# EasyEDA Pro project orpheus esp.epro

# Schematic Schematic1
Board Name: Board1; Create Date: 2025-08-03; Page Name: P1; Project Name: orpheus esp; Schematic Name: Schematic1; Update Date: 2025-08-04; Company: EasyEDA.com; Page Size: A4; Version: V1.0
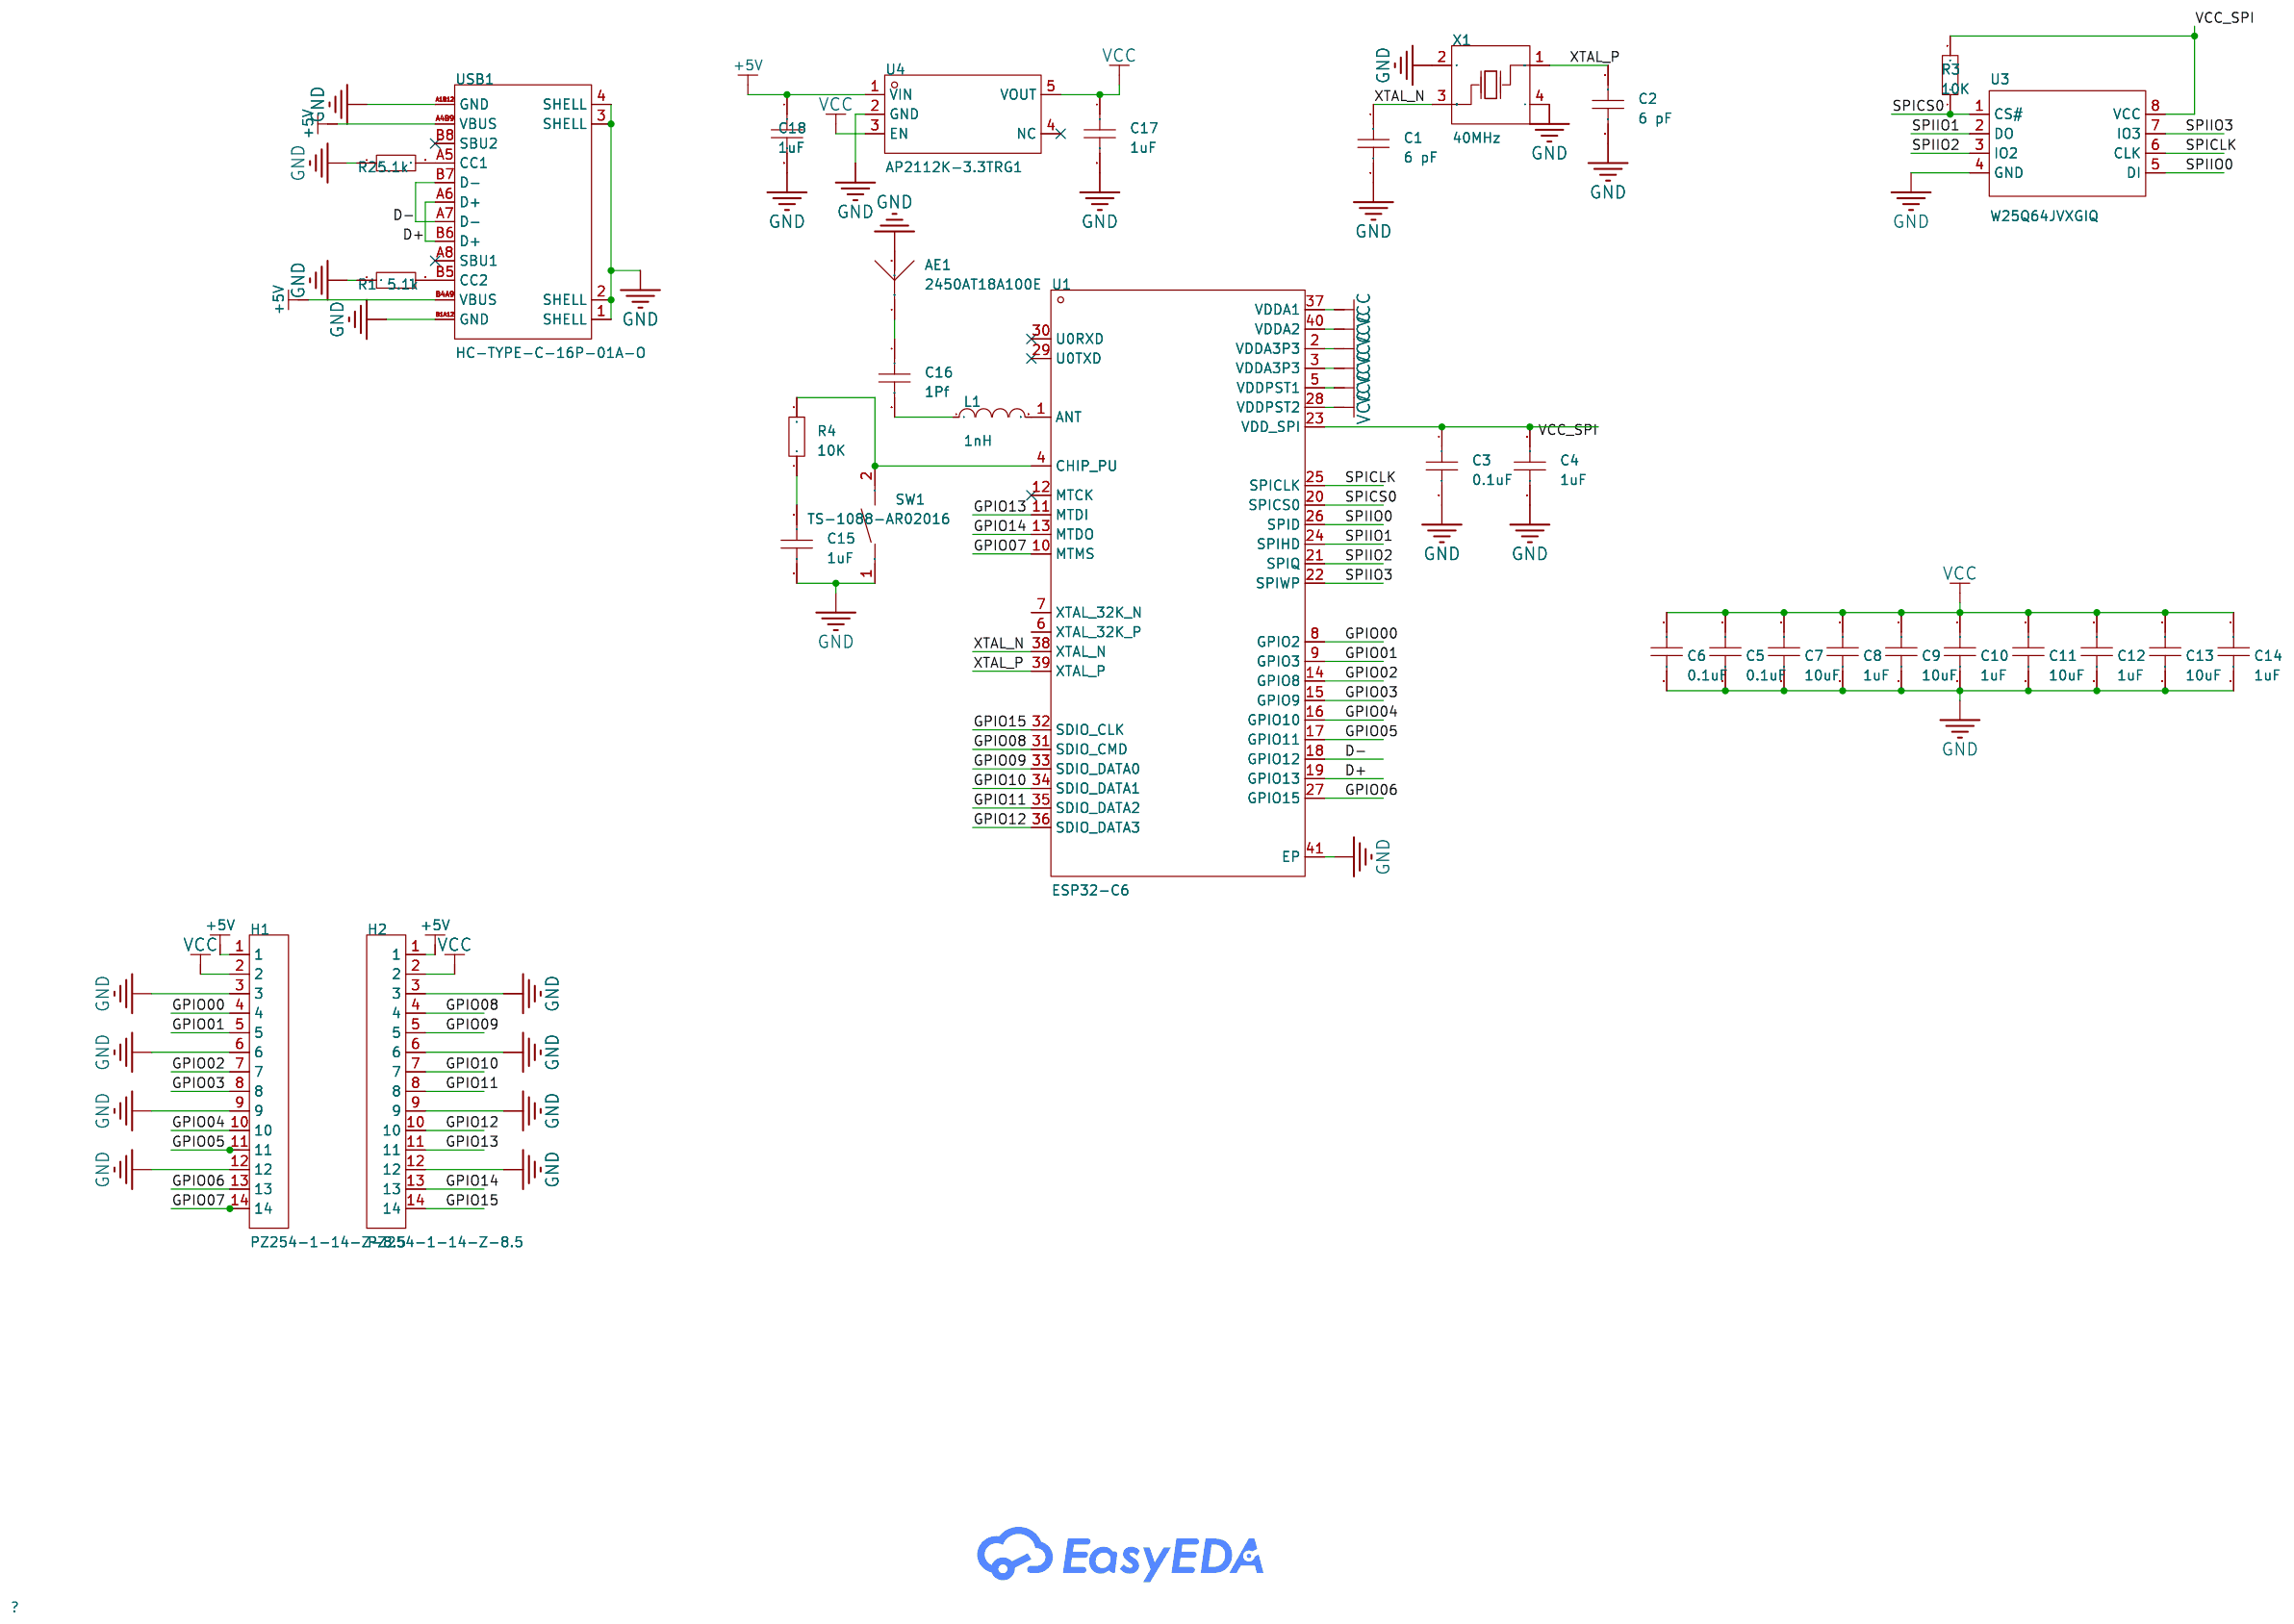
[diagram p0: schematic sheet]

## Parts
AE1  2450AT18A100E  [ANT-SMD_L3.2-W1.6]
C1  6 pF  [C0402_NEW]
C2  6 pF  [C0402_NEW]
C3  0.1uF  [C0402_NEW]
C4  1uF  [C0402_NEW]
C5  0.1uF  [C0402_NEW]
C6  0.1uF  [C0402_NEW]
C7  10uF  [C0402_NEW]
C8  1uF  [C0402_NEW]
C9  10uF  [C0402_NEW]
C10  1uF  [C0402_NEW]
C11  10uF  [C0402_NEW]
C12  1uF  [C0402_NEW]
C13  10uF  [C0402_NEW]
C14  1uF  [C0402_NEW]
C15  1uF  [C0402_NEW]
C16  1Pf  [C0402_NEW]
C17  1uF  [C0402]
C18  1uF  [C0402]
H1  PZ254-1-14-Z-8.5  [HDR-TH_14P-P2.54-V-M]
H2  PZ254-1-14-Z-8.5  [HDR-TH_14P-P2.54-V-M]
L1  1nH  [L0402-SMD_L1.0-W0.5-MLK1005S7N5JTD25]
R1  5.1k  [R0603]
R2  5.1k  [R0603]
R3  10K  [R0603]
R4  10K  [R0603]
SW1  TS-1088-AR02016  [SW-SMD_L3.9-W3.0-P4.45]
U1  ESP32-C6  [QFN-40_L5.0-W5.0-P0.40-TL-EP3.3]
U3  W25Q64JVXGIQ  [XSON-8_L4.0-W4.0-P0.80-TL-EP]
U4  AP2112K-3.3TRG1  [SOT-25-5_L2.9-W1.6-P0.95-LS2.8-BL]
USB1  HC-TYPE-C-16P-01A-O  [USB-C-SMD_G-SWITCH_GT-USB-7010EN]
X1  40MHz  [CRYSTAL-SMD_4P-L2.0-W1.6-BL]

## Library data of the parts
AE1 = 2450AT18A100E: Antenna Type:2.4G天线 Central Frequency:2.4GHz Bandwidth:- Peak Gain:0.5dBi Peak Gain:0.5dBi Polarization Type:- Impedance:50Ω Power capacity:2W VSWR:- Operating Temperature:-40℃~+125℃ Operating Temperature:-40℃~+125℃; LCSC Part Name: 2.4G天线; Supplier Part: C89334; Manufacturer: JOHANSON(约翰逊); Supplier Footprint: 1206; JLCPCB Part Class: Extended Part; Datasheet: https://atta.szlcsc.com/upload/public/pdf/source/20180301/C89334_15198946260391384223.pdf; Supplier: LCSC; Antenna Type: 2.4G天线; Central Frequency: 2.4GHz; Peak Gain: 0.5dBi; Impedance: 50Ω; Power capacity: 2W; Operating Temperature: -40℃~+125℃
C1-C16 = CAP_0603: Supplier Footprint: 0603
C17 C18 = CAP_0402: Supplier Part: C1525; Supplier Footprint: 0402
H1 H2 = PZ254-1-14-Z-8.5: Pin Structure:1x14P Pitch:2.54mm Row Spacing:- Circluar Pins/Square Pins:Policy Mounting Type:Straight Number of Rows:Single Row Number of Pins:14P Current Rating:3A Voltage Rating (Max):- Length of Mating Pin:6mm Insulation Height:2.5mm Length of End Con; LCSC Part Name: 1x14P 间距:2.54mm 方针 直插; Supplier Part: C2894937; Manufacturer: HCTL(华灿天禄); Supplier Footprint: 插件,P=2.54mm; JLCPCB Part Class: Extended Part; Datasheet: https://atta.szlcsc.com/upload/public/pdf/source/20240305/0F0A2A5C422E5D195558C9C26715A031.pdf; Supplier: LCSC; Pin Structure: 1x14P; Pitch: 2.54mm; Circluar Pins/Square Pins: Policy; Mounting Type: Straight; Number of Rows: Single Row; Number of Pins: 14P; Current Rating: 3A; Length of Mating Pin: 6mm; Insulation Height: 2.5mm; Length of End Connection Pin: 3mm; Contact Material: Brass; Operating Temperature: -40℃~+105℃; Color: Black
L1 = L_0603: Supplier Footprint: L0603
R1-R4 = Res_0603: Supplier Footprint: 0603
SW1 = TS-1088-AR02016: Circuit:SPST Actuator Style:Round Button Operating Force:160gf Mounting Style:Brick nogging Switch Length:4mm Switch Width:3mm Switch Height:2mm Strike Gundam:不带 Contact Current:50mA Voltage Rating (DC):12V Insulation Resistance:100MΩ Actuator/Cap Color:B; LCSC Part Name: 4*3*2mm 立贴 轻触开关; Supplier Part: C720477; Manufacturer: XUNPU(讯普); Supplier Footprint: SMD; JLCPCB Part Class: Basic Part; Datasheet: https://atta.szlcsc.com/upload/public/pdf/source/20200810/C720475_60D09DD6C54279ADDB2DC25100F1CC11.pdf; Supplier: LCSC; Circuit: SPST; Actuator Style: Round Button; Operating Force: 160gf; Mounting Style: Brick nogging; Switch Length: 4mm; Switch Width: 3mm; Switch Height: 2mm; Strike Gundam: 不带; Contact Current: 50mA; Voltage Rating (DC): 12V; Insulation Resistance: 100MΩ; Actuator/Cap Color: Black; Pin Style: SMDSplicing; Mechanical Life: 10万次; Operating Temperature: -30℃~+80℃
U1 = ESP32-C6_C5364646: Supplier Part: C5364646; Manufacturer: ESPRESSIF(乐鑫); Supplier Footprint: QFN-40-EP(5x5); JLCPCB Part Class: Extended Part; Datasheet: https://atta.szlcsc.com/upload/public/pdf/source/20241030/E440DE1A2E0B008553116CD300713F6D.pdf; Supplier: LCSC
U3 = W25Q64JVXGIQ: Interface:SPI Memory Size:64Mbit Clock Frequency:133MHz Voltage - Supply:2.7V~3.6V Voltage - Supply:2.7V~3.6V Program / Erase Cycles:100,000 Cycles Page Programming Time (Tpp):3ms Data Retention - TDR (Year):20 Years; Supplier Part: C2940195; Manufacturer: Winbond(华邦); Supplier Footprint: XSON-8-EP(4x4); JLCPCB Part Class: Extended Part; Datasheet: https://atta.szlcsc.com/upload/public/pdf/source/20220111/96C134BA110DAC08742B3CB6C4519B4C.pdf; Supplier: LCSC; Interface: SPI; Memory Size: 64Mbit; Clock Frequency: 133MHz; Voltage - Supply: 2.7V~3.6V; Program / Erase Cycles: 100,000 Cycles; Page Programming Time (Tpp): 3ms; Data Retention - TDR (Year): 20 Years
U4 = AP2112K-3.3TRG1: Output Type:Fixed Voltage - Supply:6V Output Voltage:3.3V Output Voltage:3.3V Output Current:600mA Power Supply Rejection Ratio (PSRR):65dB@(1kHz) Voltage Dropout:250mV@(600mA) standby current:55uA Noise:50uVrms Features:Enable；Over Temperature Protection; LCSC Part Name: 输入6V 输出3.3V 600mA; Supplier Part: C51118; Manufacturer: DIODES(美台); Supplier Footprint: SOT-25-5; JLCPCB Part Class: Extended Part; Datasheet: https://atta.szlcsc.com/upload/public/pdf/source/20171221/C51118_15138312998391195590.pdf; Supplier: LCSC; Output Type: Fixed; Voltage - Supply: 6V; Output Voltage: 3.3V; Output Current: 600mA; Power Supply Rejection Ratio (PSRR): 65dB@(1kHz); Voltage Dropout: 250mV@(600mA); standby current: 55uA; Noise: 50uVrms; Features: Enable；Over Temperature Protection；Over Current Protection; Operating Temperature: -40℃~+85℃@(Ta); Output Configuration: Positive; Number of Outputs: 1
USB1 = HC-TYPE-C-16P-01A-O: Connector Type:Type-C Standard:USB 3.1 Gender:Female Number of Ports:1 Number of Contacts:16P Mounting Style:卧贴 Current Rating - Power (Max):3A Contact Material:高导铜 Contact Plating:Gold Operating Temperature Range:-25℃~+85℃ Operating Temperature Range:-25; LCSC Part Name: Type-C 母 卧贴; Supplier Part: C2997434; Manufacturer: HCTL(华灿天禄); Supplier Footprint: SMD; JLCPCB Part Class: Extended Part; Datasheet: https://atta.szlcsc.com/upload/public/pdf/source/20221116/BA0148F97D59795AA936F4E81C149370.pdf; Supplier: LCSC; Connector Type: Type-C; Standard: USB 3.1; Gender: Female; Number of Ports: 1; Number of Contacts: 16P; Mounting Style: 卧贴; Current Rating - Power (Max): 3A; Contact Material: 高导铜; Contact Plating: Gold; Operating Temperature Range: -25℃~+85℃; Soldering Temperature(Max): 260℃
X1 = Q22FA12800101: Type:Surface Mount Crystal Frequency:40MHz Normal temperature Frequency Tolerance:±10ppm Normal temperature Frequency Tolerance:±10ppm Load Capacitance: Equivalent Series Resistance(ESR):60Ω Operating Temperature:-40℃~+85℃ Operating Temperature:-40℃~+85℃; LCSC Part Name: 40MHz ±10ppm 10pF; Supplier Part: C255898; Manufacturer: EPSON(爱普生); Supplier Footprint: SMD2016-4P; JLCPCB Part Class: Extended Part; Datasheet: https://atta.szlcsc.com/upload/public/pdf/source/20221017/9A6075544027D4D0443F23E2E889A9CE.pdf; Supplier: LCSC; Type: Surface Mount Crystal; Normal temperature Frequency Tolerance: ±10ppm; Equivalent Series Resistance(ESR): 60Ω; Operating Temperature: -40℃~+85℃

## Nets
+5V: C18.1 H1.1 H2.1 U4.1(VIN) USB1.A4B9(VBUS) USB1.B4A9(VBUS)
GND: AE1.2 C1.2 C2.2 C3.2 C4.1 C5.2 C6.2 C7.2 C8.2 C9.2 C10.2 C11.2 C12.2 C13.2 C14.2 C15.2 C17.2 C18.2 H1.3 H1.6 H1.9 H1.12 H2.3 H2.6 H2.9 H2.12 R1.1 R2.1 SW1.1 U1.41(EP) U3.4(GND) U4.2(GND) USB1.1(SHELL) USB1.2(SHELL) USB1.3(SHELL) USB1.4(SHELL) USB1.A1B12(GND) USB1.B1A12(GND) X1.2 X1.4
VCC: C5.1 C6.1 C7.1 C8.1 C9.1 C10.1 C11.1 C12.1 C13.1 C14.1 C17.1 H1.2 H2.2 U1.2(VDDA3P3) U1.3(VDDA3P3) U1.5(VDDPST1) U1.28(VDDPST2) U1.37(VDDA1) U1.40(VDDA2) U4.3(EN) U4.5(VOUT)
VCC_SPI: C3.1 C4.2 R3.2 U1.23(VDD_SPI) U3.8(VCC)
D+: U1.19(GPIO13) USB1.A6(D+) USB1.B6(D+)
D-: U1.18(GPIO12) USB1.A7(D-) USB1.B7(D-)
GPIO00: H1.4 U1.8(GPIO2)
GPIO01: H1.5 U1.9(GPIO3)
GPIO02: H1.7 U1.14(GPIO8)
GPIO03: H1.8 U1.15(GPIO9)
GPIO04: H1.10 U1.16(GPIO10)
GPIO05: H1.11 U1.17(GPIO11)
GPIO06: H1.13 U1.27(GPIO15)
GPIO07: H1.14 U1.10(MTMS)
GPIO08: H2.4 U1.31(SDIO_CMD)
GPIO09: H2.5 U1.33(SDIO_DATA0)
GPIO10: H2.7 U1.34(SDIO_DATA1)
GPIO11: H2.8 U1.35(SDIO_DATA2)
GPIO12: H2.10 U1.36(SDIO_DATA3)
GPIO13: H2.11 U1.11(MTDI)
GPIO14: H2.13 U1.13(MTDO)
GPIO15: H2.14 U1.32(SDIO_CLK)
SPICLK: U1.25(SPICLK) U3.6(CLK)
SPICS0: R3.1 U1.20(SPICS0) U3.1(CS#)
SPIIO0: U1.26(SPID) U3.5(DI)
SPIIO1: U1.24(SPIHD) U3.2(DO)
SPIIO2: U1.21(SPIQ) U3.3(IO2)
SPIIO3: U1.22(SPIWP) U3.7(IO3)
XTAL_N: C1.1 U1.38(XTAL_N) X1.3(OSC2)
XTAL_P: C2.1 U1.39(XTAL_P) X1.1(OSC1)
$1N4699: R1.2 USB1.B5(CC2)
$1N4816: R2.2 USB1.A5(CC1)
$1N7117: C15.1 R4.1
$1N7121: R4.2 SW1.2 U1.4(CHIP_PU)
$1N7767: L1.2 U1.1(ANT)
$1N7915: C16.2 L1.1
$1N7919: AE1.1(ANT) C16.1

Not connected (* = marked no-connect by the designer): U1 6(XTAL_32K_P) 7(XTAL_32K_N) 12(MTCK)* 29(U0TXD)* 30(U0RXD)*; U4 4(NC)*; USB1 A8(SBU1)* B8(SBU2)*

# Board PCB1
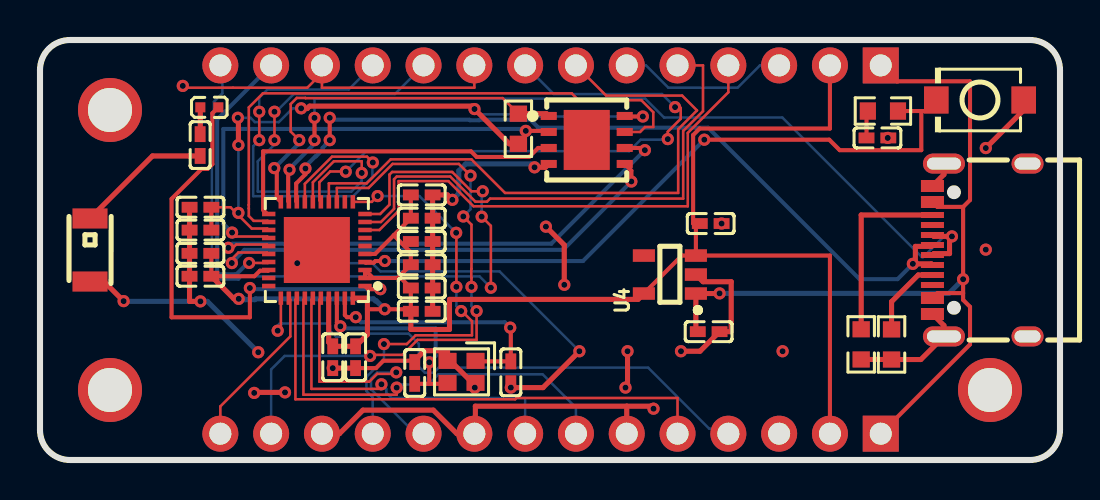
[diagram p1: board, top side]
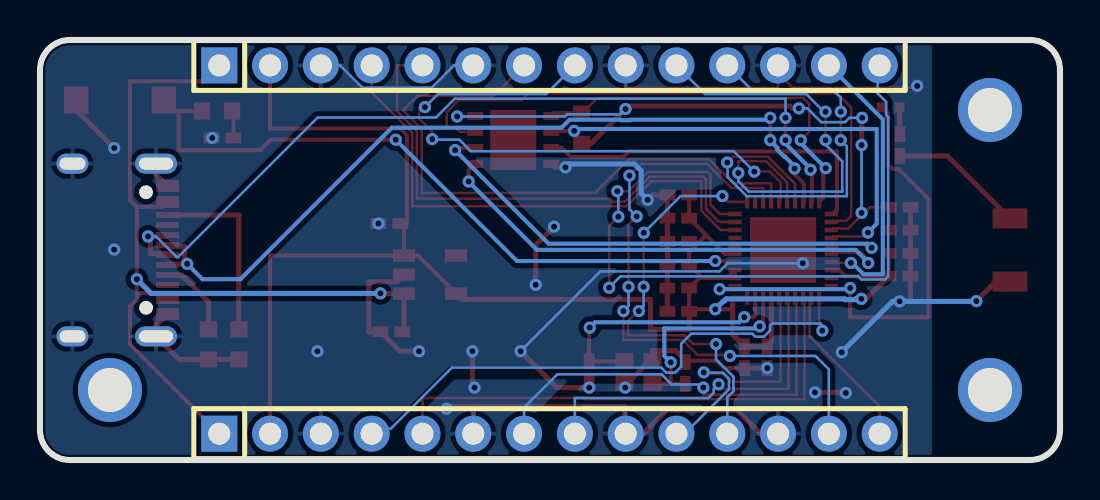
[diagram p2: board, bottom side, seen from below]

Outline 51 x 21 mm; copper layers: Top Layer, Bottom Layer. Coordinates in mm from the lower left corner of the outline.
Outline path: 0,19.5 0,1.5 arc(0.44,0.44) 1.5,0 49.5,0 arc(50.56,0.44) 51,1.5 51,19.5 arc(50.56,20.56) 49.5,21 1.5,21 arc(0.44,20.56) 0,19.5
Stack: Top Layer 0.035mm / Dielectric1 1.51mm FR4 er 4.5 / Bottom Layer 0.035mm

## Design rules (mm)
template: JLCPCB Capability(Two Layers Board)
spacing copperThickness1oz (default): track to track 0.102, other pairs 0.152 to 0.3
spacing copperThickness2oz: track to track 0.203, other pairs 0.152 to 0.3
track width copperThickness1oz (default): min 0.127, default 0.254, max 2.54
track width copperThickness2oz: min 0.203, default 0.254, max 2.54
differential pair differentialPair (default): width min 0.127, default 0.254, max 2.54; gap min 0.152, default 0.152
via viaSize (default): diameter min 0.5, default 0.61, max 10; hole min 0.3, default 0.305, max 6.3

## Placement (name value [footprint] x y rotation side)
AE1  2450AT18A100E  [ANT-SMD_L3.2-W1.6]  2.5 10.5 270 top
C1  6 pF  [C0402_NEW]  18.74 4.35 90 top
C2  6 pF  [C0402_NEW]  23.54 4.39 270 top
C3  0.1uF  [C0402_NEW]  8.02 11.49 180 top
C4  1uF  [C0402_NEW]  8.02 12.64 0 top
C5  0.1uF  [C0402_NEW]  8.02 9.19 180 top
C6  0.1uF  [C0402_NEW]  8.02 10.33 180 top
C7  10uF  [C0402_NEW]  19.09 13.25 0 top
C8  1uF  [C0402_NEW]  19.09 12.09 0 top
C9  10uF  [C0402_NEW]  19.09 10.93 0 top
C10  1uF  [C0402_NEW]  19.09 9.76 0 top
C11  10uF  [C0402_NEW]  19.09 8.6 0 top
C12  1uF  [C0402_NEW]  19.09 7.43 0 top
C13  10uF  [C0402_NEW]  15.78 5.14 270 top
C14  1uF  [C0402_NEW]  14.64 5.14 270 top
C15  1uF  [C0402_NEW]  41.87 16.1 0 top
C16  1Pf  [C0402_NEW]  8.01 15.75 90 top
C17  1uF  [C0402]  33.53 11.82 0 top
C18  1uF  [C0402]  33.43 6.42 0 top
H1  PZ254-1-14-Z-8.5  [HDR-TH_14P-P2.54-V-M]  25.53 19.73 180 bottom
H2  PZ254-1-14-Z-8.5  [HDR-TH_14P-P2.54-V-M]  25.53 1.31 180 bottom
L1  1nH  [L0402-SMD_L1.0-W0.5-MLK1005S7N5JTD25]  8.47 17.63 0 top
NOREF  -  [Pad_e2297]  47.5 3.5 0 top
NOREF#2  -  [Pad_e2300]  3.5 17.5 0 top
NOREF#3  -  [Pad_e2299]  3.5 3.5 0 top
R1  5.1k  [R0603]  41.06 5.78 90 top
R2  5.1k  [R0603]  42.58 5.78 90 top
R3  10K  [R0603]  23.92 16.56 270 top
R4  10K  [R0603]  42.15 17.45 0 top
SW1  TS-1088-AR02016  [SW-SMD_L3.9-W3.0-P4.45]  47 18 180 top
U1  ESP32-C6  [QFN-40_L5.0-W5.0-P0.40-TL-EP3.3]  13.84 10.5 180 top
U3  W25Q64JVXGIQ  [XSON-8_L4.0-W4.0-P0.80-TL-EP]  27.34 16 0 top
U4  AP2112K-3.3TRG1  [SOT-25-5_L2.9-W1.6-P0.95-LS2.8-BL]  31.49 9.27 90 top
USB1  HC-TYPE-C-16P-01A-O  [USB-C-SMD_G-SWITCH_GT-USB-7010EN]  47 10.5 90 top
X1  40MHz  [CRYSTAL-SMD_4P-L2.0-W1.6-BL]  21.08 4.41 180 top

## Footprints (pads in the part's own frame, mm; a bottom-side part is the same pattern mirrored in y, then rotated)
ANT-SMD_L3.2-W1.6
  rect 1x1.75 smd: 1(-1.578,0) 2(1.578,0)
C0402
  rect 0.79x0.54 smd: 1(-0.545,0) 2(0.545,0)
C0402_NEW
  rect 0.79x0.54 smd: 1(-0.545,0) 2(0.545,0)
CRYSTAL-SMD_4P-L2.0-W1.6-BL
  rect 0.9x0.8 smd: 1(-0.7,-0.55) 2(0.7,-0.55) 3(0.7,0.55) 4(-0.7,0.55)
HDR-TH_14P-P2.54-V-M
  rect 1.8x1.8 hole 1.1: 1(-16.51,0)
  round 1.8 hole 1.1: 2(-13.97,0) 3(-11.43,0) 4(-8.89,0) 5(-6.35,0) 6(-3.81,0) 7(-1.27,0) 8(1.27,0) 9(3.81,0) 10(6.35,0) 11(8.89,0) 12(11.43,0) 13(13.97,0) 14(16.51,0)
L0402-SMD_L1.0-W0.5-MLK1005S7N5JTD25
  rect 0.5x0.5 smd: 1(-0.45,0) 2(0.45,0)
Pad_e2297
  round 3.2 hole 2.2: 1(0,0)
Pad_e2299
  round 3.2 hole 2.2: 1(0,0)
Pad_e2300
  round 3.2 hole 2.2: 1(0,0)
QFN-40_L5.0-W5.0-P0.40-TL-EP3.3
  rect 0.665x0.224 smd: 1(-2.408,1.8) 2(-2.408,1.4) 3(-2.408,1) 4(-2.408,0.6) 5(-2.408,0.2) 6(-2.408,-0.2) 7(-2.408,-0.6) 8(-2.408,-1) 9(-2.408,-1.4) 10(-2.408,-1.8) 21(2.408,-1.8) 22(2.408,-1.4) 23(2.408,-1) 24(2.408,-0.6) 25(2.408,-0.2) 26(2.408,0.2) 27(2.408,0.6) 28(2.408,1) 29(2.408,1.4) 30(2.408,1.8)
  rect 0.224x0.665 smd: 11(-1.8,-2.408) 12(-1.4,-2.408) 13(-1,-2.408) 14(-0.6,-2.408) 15(-0.2,-2.408) 16(0.2,-2.408) 17(0.6,-2.408) 18(1,-2.408) 19(1.4,-2.408) 20(1.8,-2.408) 31(1.8,2.408) 32(1.4,2.408) 33(1,2.408) 34(0.6,2.408) 35(0.2,2.408) 36(-0.2,2.408) 37(-0.6,2.408) 38(-1,2.408) 39(-1.4,2.408) 40(-1.8,2.408)
  rect 3.3x3.3 smd: 41(0,0)
R0603
  rect 0.806x0.864 smd: 1(-0.753,0) 2(0.753,0)
SOT-25-5_L2.9-W1.6-P0.95-LS2.8-BL
  rect 0.623x1.105 smd: 1(-0.95,-1.3) 2(-0.001,-1.3) 3(0.95,-1.3) 4(0.95,1.3) 5(-0.95,1.3)
SW-SMD_L3.9-W3.0-P4.45
  rect 1.23x1.36 smd: 1(-2.185,0) 2(2.185,0)
USB-C-SMD_G-SWITCH_GT-USB-7010EN
  oval 1x2.1 hole 0.6x1.7: 1(-4.32,1.802) 2(4.32,1.802)
  oval 1x1.6 hole 0.6x1.3: 3(4.32,-2.377) 4(-4.32,-2.377)
  rect 0.6x1.15 smd: A1B12(-3.2,2.377) A4B9(-2.4,2.377) B1A12(3.2,2.377) B4A9(2.4,2.377)
  rect 0.3x1.15 smd: A5(-1.25,2.377) A6(-0.25,2.377) A7(0.25,2.377) A8(1.25,2.377) B5(1.75,2.377) B6(0.75,2.377) B7(-0.75,2.377) B8(-1.75,2.377)
XSON-8_L4.0-W4.0-P0.80-TL-EP
  rect 0.8x0.4 smd: 1(-1.9,1.2) 2(-1.9,0.4) 3(-1.9,-0.4) 4(-1.9,-1.2) 5(1.9,-1.2) 6(1.9,-0.4) 7(1.9,0.4) 8(1.9,1.2)
  rect 2.3x3 smd: 9(0,0)

## Nets
As in the schematic.

Pads without a net: NOREF 1; NOREF#2 1; NOREF#3 1; U1 6 7 12 29 30; U3 9; U4 4; USB1 A8 B8

## Via types
v1: diameter 0.61, hole 0.305, Top Layer to Bottom Layer, 85 vias

## Routing (per net, layer and track width the routed paths; a pad name or vN(x,y) marks a point on that pad's centre or on a via; arc(x,y) is an arc through that point)
+5V: length 43.4
  Top Layer w0.203: H1.1 42.83,18.93 46.5,18.93 46.5,13 46.16,12.65 ; USB1.A4B9 44.87,8.35 46.16,8.35 ; 46.16,8.35 v1(46.16,9.04) 46.16,12.65 ; 46.16,8.35 46.16,8.01 46.5,7.66 46.5,5.78 H2.1 ; 46.16,12.65 44.87,12.65 USB1.B4A9
  Top Layer w0.254: v1(33.98,8.33) 33.97,8.32 U4.1 32.79,6.51 C18.1
  Bottom Layer w0.254: v1(46.16,9.04) 45.45,8.33 v1(33.98,8.33)
GND: length 127.9
  Top Layer w0.127: 9.66,18.61 7.14,18.61 v1(7.14,18.7) ; H1.9 21.72,18.61 14.1,18.61 14.1,19.35 ; 14.1,19.35 13.36,18.61 9.66,18.61 ; 14.1,19.35 H1.12
  Top Layer w0.203: C1.2 18.74,4.97 17.17,4.97 16.8,4.59 C13.2
  Top Layer w0.254: 7.48,12.64 C6.2 C5.2 7.48,7.93 v1(8.02,7.93) ; v1(30.68,2.56) 30.55,2.69 29.34,2.69 ; v1(14.64,4.59) C13.2 ; 29.34,2.69 H2.6 ; 29.34,2.69 21.77,2.69 21.77,1.37 H2.9 20.84,1.31 19.67,2.49 16.15,2.49 14.97,1.31 H2.12 ; v1(12.25,3.38) 10.74,3.38 v1(10.71,3.35) ; U3.4 25.27,14.63 v1(24.73,14.63) ; R1.1 42.57,5.03 R2.1 44.04,5.02 USB1.1 45.2,6.72 USB1.A1B12 ; v1(4.18,7.94) 3.2,8.92 AE1.2 ; v1(26.21,8.76) 26.21,10.75 v1(25.3,11.67) ; v1(23.54,3.62) 25.15,3.62 v1(26.97,5.44) ; SW1.1 49.19,17.49 v1(47.29,15.6) ; v1(21.74,3.62) 21.74,3.74 20.52,4.96 X1.2 20.38,5.47 19.22,5.47 18.88,5.13 18.88,5.04 C1.2 ; USB1.B1A12 45.2,14.28 USB1.2 ; U4.2 33.15,8.91 34.56,8.91 34.56,6.42 C18.2 33,5.44 v1(32.05,5.44) ; v1(20.62,13.01) 20.37,13.25 C7.2 C8.2 C9.2 C10.2 C11.2 C12.2 ; v1(29.38,5.44) 29.38,3.72 v1(29.27,3.62)
  Bottom Layer w0.127: H1.6 30.3,19.73 31.41,18.61 34.88,18.61 35.99,19.73 H1.3 ; v1(12.86,9.84) 16.61,9.84 17.03,9.43 22.98,9.43 v1(26.97,5.44)
  Bottom Layer w0.254: v1(4.18,7.94) 4.19,7.93 v1(8.02,7.93) 8.37,7.93 v1(10.91,5.39) ; v1(20.62,13.01) 20.94,13.33 20.94,14.46 21.28,14.8 24.56,14.8 v1(24.73,14.63)
  vias: v1(34.08,11.82) v1(37.13,5.44) v1(42.39,16.1) v1(47.29,10.52)
VCC: length 84.1
  Top Layer w0.203: C7.1 C8.1 16.75,10.3 U1.5 ; C6.1 C5.1 10.72,9.19 11,9.47 11.4,9.47 U1.28 ; 16.65,9.1 U1.3 U1.2 16.65,9.1 ; 16.65,9.1 17.88,9.1 ; 17.88,9.1 C10.1 18.54,10.38 17.69,11.23 ; 17.88,9.1 18.04,9.1 C11.1 C12.1 18.44,7.54 16.37,7.54 ; H1.2 39.5,16.57 32.98,16.57 32.66,16.25 32.66,11.82 C17.1 32.79,11.63 U4.3 ; U4.3 39.5,10.22 H2.2 ; U4.3 32.09,10.22 U4.5
  Top Layer w0.254: U4.5 29.9,8.03 20.47,8.03 20.47,6.53 18.54,6.53 C12.1 ; C5.1 9.7,8.06 v1(9.93,8.06) ; 14.44,8.09 14.43,8.08 14.43,5.89 C14.1 C13.1 16.37,6.28 16.37,8.09 U1.40
  Bottom Layer w0.254: v1(9.93,8.06) 10.21,8.06 10.25,8.02 10.74,8.02 10.78,8.06 16.67,8.06 16.77,7.96 16.82,7.96 v1(17.24,7.54)
VCC_SPI: length 34
  Top Layer w0.127: U1.23 11.36,11.57 10.59,11.57 9.52,12.64 C4.2
  Top Layer w0.203: v1(30.14,17.17) 29.26,17.17 U3.8 ; C4.2 C3.1
  Top Layer w0.254: v1(9.92,15.75) 9.92,17.08 v1(9.89,17.11) ; v1(13.06,17.58) 13.07,17.57 13.36,17.57 13.48,17.69 21.58,17.69 v1(21.72,17.55) 23.46,15.81 R3.2
  Bottom Layer w0.127: v1(30.14,17.17) 24.74,17.17 24.63,17.28 21.99,17.28 v1(21.72,17.55) ; v1(13.06,17.58) 12.63,17.58 11.94,16.89 10.75,16.89 10.53,17.11 v1(9.89,17.11) ; v1(9.92,15.75) v1(9.92,12.36)
D+: length 44
  Top Layer w0.203: v1(12.48,14.51) 12.41,14.45 12.41,12.94 12.44,12.91 ; v1(13.72,17.11) v1(13.72,15.99)
  Top Layer w0.254: USB1.B6 44.69,11.18 45.55,11.18 45.48,11.1 45.48,10.32 44.69,10.32 USB1.A6
  Bottom Layer w0.127: v1(13.72,17.11) 13.72,18.07 30.26,18.07 31.2,17.12 37.12,17.12 44.1,10.14 44.16,10.14 45.2,11.18 v1(45.6,11.18)
  Bottom Layer w0.203: v1(13.72,15.99) 13.72,15.82 12.48,14.57 v1(12.48,14.51)
D-: length 40.5
  Top Layer w0.203: v1(13.27,14.57) 13.27,14.29 12.81,13.82 12.81,12.94 U1.18 ; v1(14.49,15.99) v1(14.49,17.11)
  Top Layer w0.254: USB1.B7 44.56,9.81 43.68,9.81 43.77,9.9 43.77,10.68 44.55,10.68 USB1.A7
  Bottom Layer w0.203: v1(13.27,14.57) 13.27,14.68 13.78,15.19 13.8,15.19 14.13,15.51 14.13,15.61 14.28,15.76 14.28,15.79 v1(14.49,15.99) ; v1(43.64,9.81) 42.88,9.04 40.98,9.04 33.4,16.62 24.92,16.62 24.52,17.01 21.98,17.01 21.96,16.99 21.49,16.99 21.47,17.01 14.58,17.01 v1(14.49,17.11)
GPIO00: length 26.4
  Top Layer w0.127: U1.8 16.97,11.5 17.93,12.46 17.93,13.94 20.42,13.94 21.68,12.69 32.39,12.69 32.39,16.36 34.42,18.39 H1.4
GPIO01: length 26.6
  Top Layer w0.127: H1.5 33.15,19.73 33.15,17.44 32.16,16.45 32.16,13.07 22.5,13.07 22.35,12.92 21.77,12.92 20.51,14.17 17.84,14.17 17.7,14.04 17.7,12.56 17.05,11.9 U1.9
GPIO02: length 31.1
  Top Layer w0.127: 14.44,12.91 14.44,13.83 16.33,13.83 17.54,15.03 21.57,15.03 23.25,13.35 31.91,13.35 31.91,16.54 32.85,17.48 32.11,18.22 28.31,18.22 H1.7
GPIO03: length 29.8
  Top Layer w0.127: 14.04,12.91 13.97,12.98 13.97,13.89 14.51,14.43 15.28,14.43 v1(15.29,14.42) ; v1(31.75,17.64) 31.99,17.64 32.04,17.6 32.04,17.06 31.39,16.41 v1(31.39,16.05)
  Bottom Layer w0.127: v1(31.39,16.05) 31.36,16.01 30.03,16.01 29.46,15.44 16.31,15.44 v1(15.29,14.42) ; H1.8 25.69,18.3 31.1,18.3 v1(31.75,17.64)
GPIO04: length 23.2
  Top Layer w0.127: v1(16.09,14.35) 16.09,14.94 14.7,14.94 13.64,13.88 U1.16 ; v1(11.72,17.41) v1(11.72,15.99) ; v1(11.72,15.99) 11.72,15.99 11.72,15.93 11.72,15.93 v1(11.72,15.99)
  Bottom Layer w0.127: H1.10 17.74,18.3 12.69,18.3 11.81,17.41 v1(11.72,17.41) ; v1(16.09,14.35) 16.09,13.94 15.56,13.42 10.89,13.42 10.89,14.93 11.72,15.77 v1(11.72,15.99)
GPIO05: length 23.5
  Top Layer w0.127: U1.17 13.24,13.81 14.6,15.17 16.35,15.17 v1(16.64,14.87) ; v1(10.96,15.99) v1(10.96,17.41)
  Bottom Layer w0.127: v1(10.96,15.99) 10.66,15.69 10.66,13.19 15.66,13.19 16.62,14.15 16.62,14.85 v1(16.64,14.87) ; v1(10.96,17.41) 10.96,18.11 11.37,18.53 15.43,18.53 H1.11
GPIO06: length 14.4
  Top Layer w0.127: v1(10.46,9.85) 11.39,9.85 U1.27
  Bottom Layer w0.203: v1(10.46,9.85) 10.38,9.85 9.82,9.29 8.86,9.29 8.86,17.03 H1.13
GPIO07: length 38.2
  Top Layer w0.127: v1(22.54,8.61) 22.54,11.71 v1(22.08,12.17) ; U1.10 17.01,12.3 17.47,12.77 17.47,14.27 17.61,14.4 20.61,14.4 21.57,13.44 v1(22.13,13.44)
  Bottom Layer w0.127: H1.14 9.12,19.63 9.12,18.33 8.69,17.91 8.69,17.24 8.59,17.14 8.59,9.18 8.75,9.02 9.93,9.02 10.09,9.18 21.98,9.18 v1(22.54,8.61) ; v1(22.08,12.17) 22.08,13.39 v1(22.13,13.44)
GPIO08: length 28
  Top Layer w0.127: v1(11.88,6.47) 12.04,6.62 12.04,8.09
  Bottom Layer w0.127: v1(11.88,6.47) 11.88,6.72 11.99,6.82 14.4,6.82 14.5,6.72 14.5,6.47 14.8,6.16 15.23,6.16 15.39,6.32 18.43,6.32 18.94,5.81 18.94,4.67 19.25,4.36 19.68,4.36 19.93,4.62 30.41,4.62 33.45,1.57 34.16,1.57 H2.4
GPIO09: length 26
  Top Layer w0.127: U1.33 12.77,8.02 12.77,3.04 23.76,3.04 23.82,3.1 31.88,3.1 H2.5
GPIO10: length 21.1
  Top Layer w0.127: v1(17.83,3.62) 17.83,3.27 13.17,3.27 13.17,8.02 U1.34
  Bottom Layer w0.127: v1(17.83,3.62) 17.99,3.77 19.41,3.77 19.93,4.29 25.13,4.29 26.8,2.62 H2.7
GPIO11: length 17.7
  Top Layer w0.127: U1.35 13.57,8.02 13.57,3.56 17.07,3.56 v1(17.07,3.79)
  Bottom Layer w0.127: H2.8 24.26,3.1 17.58,3.1 17.31,3.36 17.31,3.54 v1(17.07,3.79)
GPIO12: length 13.7
  Top Layer w0.127: 14.04,8.09 13.97,8.02 13.97,3.92 16.47,3.92 16.86,4.31 17.81,4.31 v1(17.81,4.38)
  Bottom Layer w0.127: v1(17.81,4.38) 17.8,4.37 16.86,4.37 16.55,4.06 16.55,3.54 18.77,1.31 H2.10
GPIO13: length 21.1
  Top Layer w0.127: v1(20.81,11.36) 20.82,11.35 v1(20.82,8.66) ; v1(17.2,5.8) 18.34,5.8 18.78,6.23 21.6,6.23 21.6,6.94 21.09,7.45 v1(21.06,7.45) ; U1.11 16.59,12.91 v1(16.88,13.2)
  Bottom Layer w0.127: v1(20.81,11.36) 18.97,13.2 v1(16.88,13.2) ; v1(17.2,5.8) 17.2,5.03 16.32,4.16 16.32,3.44 16.64,3.13 H2.11 ; v1(21.06,7.45) 20.82,7.69 v1(20.82,8.66)
GPIO14: length 30.9
  Top Layer w0.127: v1(21.57,8.66) 21.57,9.11 21.56,9.12 21.56,9.55 21.57,9.56 21.57,11.77 v1(21.17,12.18) ; v1(16.51,5.2) 16.56,5.26 18.13,5.26 18.87,6.01 21.83,6.01 v1(21.83,7.45) ; v1(21.53,14.22) 20.94,14.8 17.63,14.8 16.43,13.6 14.84,13.6 U1.13
  Bottom Layer w0.127: v1(21.53,14.22) 21.53,12.54 v1(21.17,12.18) ; v1(21.57,8.66) 21.57,7.7 v1(21.83,7.45) ; v1(16.51,5.2) 12.23,5.2 11.56,4.53 H2.13
GPIO15: length 8.3
  Top Layer w0.127: 12.44,8.09 12.52,8.02 12.52,6.18 9.02,2.68 H2.14
SPICLK: length 26
  Top Layer w0.127: v1(9.42,10.61) 9.44,10.58 9.62,10.58 9.81,10.77 11.36,10.77 U1.25
  Top Layer w0.203: U3.6 30.13,15.6 v1(30.24,15.49)
  Bottom Layer w0.203: v1(9.42,10.61) 9.62,10.81 25.56,10.81 v1(30.24,15.49)
SPICS0: length 19.1
  Top Layer w0.127: R3.1 23.91,17.32 23.14,18.09 13.28,18.09 13.27,18.1 12.84,18.1 12.54,17.8 12.54,16.42 12.96,15.99
  Top Layer w0.203: 12.04,12.91 11.84,13.11 11.84,14.47 v1(11.71,14.59)
  Top Layer w0.254: R3.1 25.32,17.32 U3.1
  Bottom Layer w0.203: v1(12.96,15.99) 12.96,15.84 v1(11.71,14.59)
SPIIO0: length 24.9
  Top Layer w0.127: U1.26 11.36,10.37 9.92,10.37 9.59,10.05 v1(9.59,9.85)
  Top Layer w0.203: U3.5 29.57,14.47 v1(29.57,13.92)
  Bottom Layer w0.203: v1(9.59,9.85) 9.79,10.05 9.79,10.08 10.22,10.51 26.15,10.51 v1(29.57,13.92)
SPIIO1: length 23.6
  Top Layer w0.127: U1.24 11.36,11.17 9.8,11.17 v1(9.6,11.37)
  Top Layer w0.203: v1(24.29,16.46) 25.38,16.46 U3.2
  Bottom Layer w0.203: v1(9.6,11.37) 9.16,11.81 9.16,16.55 24.2,16.55 v1(24.29,16.46)
SPIIO2: length 17.9
  Top Layer w0.203: U1.21 11.36,12.3 11.15,12.5 11.15,15.43 21.55,15.43 21.83,15.15 24.46,15.15 24.91,15.6 U3.3
SPIIO3: length 29.7
  Top Layer w0.127: U3.7 30.01,16.4 30.25,16.65 30.66,16.65 30.66,17.39 30.06,17.99 26.93,17.99 26.59,18.33 11.14,18.33 10.44,17.63 10.44,12.76 10.44,12.75 10.44,12.58 10.44,12.57 10.44,12.2 10.68,11.96 11.38,11.96 U1.22
XTAL_N: length 10.9
  Top Layer w0.203: U1.38 14.84,6.86 v1(15.02,6.68) ; v1(19.46,4.88) 19.46,3.81 ; 19.46,3.81 20.33,3.81 X1.3 ; 19.46,3.81 C1.1
  Bottom Layer w0.203: v1(15.02,6.68) 15.12,6.58 19.78,6.58 19.78,5.2 v1(19.46,4.88)
XTAL_P: length 12.8
  Top Layer w0.203: X1.1 21.8,4.93 C2.1 23.54,6.59 v1(23.51,6.62) ; U1.39 15.24,7.25 15.35,7.14 v1(15.79,7.14)
  Bottom Layer w0.203: v1(15.79,7.14) 16.04,6.89 23.24,6.89 v1(23.51,6.62)
$1N4699: length 9.3
  Top Layer w0.254: USB1.B5 41.06,12.25 R1.2
$1N4816: length 4
  Top Layer w0.254: USB1.A5 43.91,9.25 42.58,7.92 R2.2
$1N7117: length 1.4
  Top Layer w0.203: C15.1 41.33,17.38 41.39,17.45
$1N7121: length 34.7
  Top Layer w0.203: v1(33.21,16.02) 39.46,16.02 39.98,15.49 44.06,15.49 44.06,17.45 ; SW1.2 44.26,17.45 44.06,17.45 ; 44.06,17.45 R4.2 ; U1.4 16.28,9.87 16.69,9.87 16.77,9.95 v1(17.24,9.95)
  Bottom Layer w0.203: v1(33.21,16.02) 27.15,9.95 v1(17.24,9.95)
$1N7767: length 24.4
  Top Layer w0.203: v1(10.49,8.6) 10.49,7.13 6.58,7.13 6.58,13.06 8.08,14.55 8.38,14.55 8.62,14.79 8.62,17.34 L1.2 ; v1(17.02,8.54) 16.41,8.54 U1.1
  Bottom Layer w0.203: v1(10.49,8.6) 10.55,8.54 v1(17.02,8.54)
$1N7915: length 1.3
  Top Layer w0.254: C16.2 8.02,16.3 L1.1
$1N7919: length 6.8
  Top Layer w0.254: AE1.1 5.62,15.2 C16.1

## Copper pours and planes (outline as drawn; the poured copper is in the pictures)
GND on Top Layer: 6.45,21.71 58.6,21.71 58.6,-6.37 6.45,-6.37
GND on Bottom Layer: 6.4,22.65 58.56,22.65 58.56,-5.43 6.4,-5.43
